# EasyEDA Pro project ProPrj_WatcheRobot2.0openSource_2026-06-17.epro, board 侧边灯板
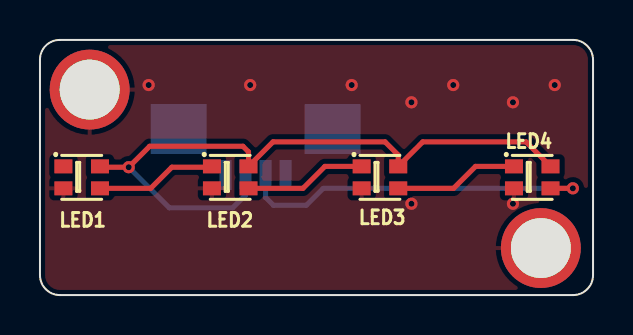
[diagram p8: board, top side]
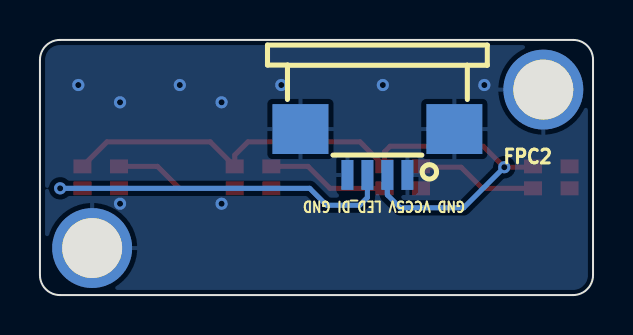
[diagram p9: board, bottom side, seen from below]

Outline 27.68 x 12.78 mm; copper layers: Top Layer, Bottom Layer. Coordinates in mm from the lower left corner of the outline.
Outline path: 0,11.79 arc(0.29,12.49) 0.99,12.78 26.68,12.78 arc(27.38,12.48) 27.68,11.78 27.68,1 arc(27.38,0.29) 26.68,0 1,0 arc(0.29,0.29) 0,1 0,11.79
Stack: Top Layer 0.035mm / Dielectric1 1.51mm FR4 er 4.5 / Bottom Layer 0.035mm

## Design rules (mm)
spacing copperThickness1oz (default): track to track 0.102, other pairs 0.152 to 0.3
spacing copperThickness2oz: track to track 0.203, other pairs 0.152 to 0.3
track width copperThickness1oz (default): min 0.127, default 0.254, max 2.54
track width copperThickness2oz: min 0.203, default 0.254, max 2.54
differential pair differentialPair (default): width min 0.127, default 0.254, max 2.54; gap min 0.152, default 0.152
net GND uses copperRegion

## Placement (name value [footprint] x y rotation side)
FPC2  FPC4_1mm(下接)  [FPC-SMD_4P-P1.00_C9900022405]  10.79 7.17 0 bottom
LED1  WS2812B-2020  [LED-SMD_4P-L2.0-W2.0-TL_WS2812B-2020]  2.09 5.9 0 top
LED2  WS2812B-2020  [LED-SMD_4P-L2.0-W2.0-TL_WS2812B-2020]  9.52 5.9 0 top
LED3  WS2812B-2020  [LED-SMD_4P-L2.0-W2.0-TL_WS2812B-2020]  17.01 5.9 0 top
LED4  WS2812B-2020  [LED-SMD_4P-L2.0-W2.0-TL_WS2812B-2020]  24.63 5.9 0 top
NOREF  -  [Pad_e23]  25.06 2.35 0 top
NOREF#2  -  [Pad_e22]  2.49 10.29 0 top

## Footprints (pads in the part's own frame, mm; a bottom-side part is the same pattern mirrored in y, then rotated)
FPC-SMD_4P-P1.00_C9900022405
  rect 0.6x1.5 smd: 1(-1.5,1.15) 2(-0.5,1.15) 3(0.5,1.15) 4(1.5,1.15)
  rect 2.8x2.5 smd: 5(3.85,-1.15) 6(-3.85,-1.15)
LED-SMD_4P-L2.0-W2.0-TL_WS2812B-2020
  rect 0.9x0.7 smd: 1(-0.915,0.55) 2(-0.915,-0.55) 3(0.915,-0.55) 4(0.915,0.55)
Pad_e22
  round 4 hole 3: (0,0)
Pad_e23
  round 4 hole 3: (0,0)

## Nets
As in the schematic, except:
GND: FPC2.1 FPC2.4 FPC2.5 FPC2.6 LED1.2 LED2.2 LED3.2 LED4.2 NOREF. NOREF#2.

Pads without a net: LED1 1

## Via types
v1: diameter 0.61, hole 0.305, Top Layer to Bottom Layer, 11 vias

## Routing (per net, layer and track width the routed paths; a pad name or vN(x,y) marks a point on that pad's centre or on a via; arc(x,y) is an arc through that point)
GND:
  vias: v1(5.44,10.52) v1(10.52,10.52) v1(15.6,10.52) v1(18.59,9.65) v1(18.59,4.57) v1(20.68,10.52) v1(23.67,9.65) v1(23.67,4.57) v1(25.76,10.52)
VCC_5V: length 34.2
  Top Layer w0.254: LED4.4 24.32,7.67 19.16,7.67 LED3.4 17.93,7.01 17.27,7.67 11.66,7.67 LED2.4 10.43,7.17 10.15,7.45 5.49,7.45 v1(4.44,6.4) 3.04,6.4 LED1.4
  Bottom Layer w0.254: FPC2.2 10.29,5.01 9.65,4.37 6.47,4.37 v1(4.44,6.4)
LED_DI: length 18.1
  Top Layer w0.254: LED4.3 v1(26.66,5.35)
  Bottom Layer w0.254: FPC2.3 11.29,4.89 11.68,4.5 13.33,4.5 14.18,5.35 v1(26.66,5.35)
$1N15: length 6.2
  Top Layer w0.254: LED4.1 21.8,6.45 20.7,5.35 LED3.3
$1N16: length 6.1
  Top Layer w0.254: LED2.3 13.16,5.35 14.26,6.45 LED3.1
$1N22: length 6.1
  Top Layer w0.254: LED2.1 8.56,6.4 6.6,6.4 5.54,5.35 LED1.3

## Copper pours and planes (outline as drawn; the poured copper is in the pictures)
GND on Top Layer: -1.28,14.66 28.57,14.66 28.57,-3.38 -1.28,-3.38
GND on Bottom Layer: -2.8,16.18 30.22,16.18 30.22,-5.03 -2.8,-5.03

## Text on the board
Bottom Silkscreen Layer: GND VCC5V LED_DI GND
